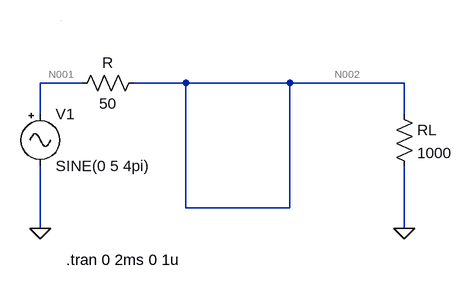
[diagram p0: schematic HW 6 #2 - Case #4.asc]
HW 6 #2 - Case #4.asc, the LTspice schematic file:
Version 4
SHEET 1 880 680
WIRE 32 96 -32 96
WIRE 192 96 112 96
WIRE 352 96 192 96
WIRE 528 96 352 96
WIRE -32 144 -32 96
WIRE 528 144 528 96
WIRE 192 288 192 96
WIRE 352 288 352 96
WIRE 352 288 192 288
WIRE -32 320 -32 224
WIRE 528 320 528 224
WIRE 0 0 0 0
FLAG -32 320 0
FLAG 528 320 0
SYMBOL Misc\\signal -32 128 R0
WINDOW 123 0 0 Left 0
WINDOW 39 0 0 Left 0
SYMATTR InstName V1
SYMATTR Value SINE(0 5 4pi)
SYMBOL res 512 128 R0
SYMATTR InstName RL
SYMATTR Value 1000
SYMBOL res 128 80 R90
WINDOW 0 0 56 VBottom 2
WINDOW 3 32 56 VTop 2
SYMATTR InstName R
SYMATTR Value 50
TEXT 8 368 Left 2 !.tran 0 2ms 0 1u

The netlist it stands for:
* HW 6 #2 - Case #4.asc
V1 N001 0 SINE(0 5 4pi)
RL N002 0 1000
R N002 N001 50
.tran 0 2ms 0 1u
.backanno
.end

* Results of the author's LTspice run, read from the files saved beside the schematic
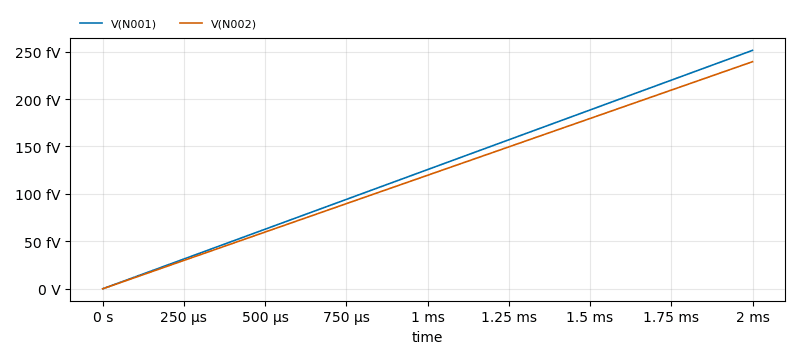
[diagram p1: Transient Analysis of HW 6 #2 - Case #4.asc, plotted from the saved traces]
* Transient Analysis, 1 run:
*   V(N001): min 0 V, max 251.3 fV, average 125.7 fV, rms 153.9 fV, last 251.3 fV
*   V(N002): min 0 V, max 239.4 fV, average 119.7 fV, rms 146.6 fV, last 239.4 fV